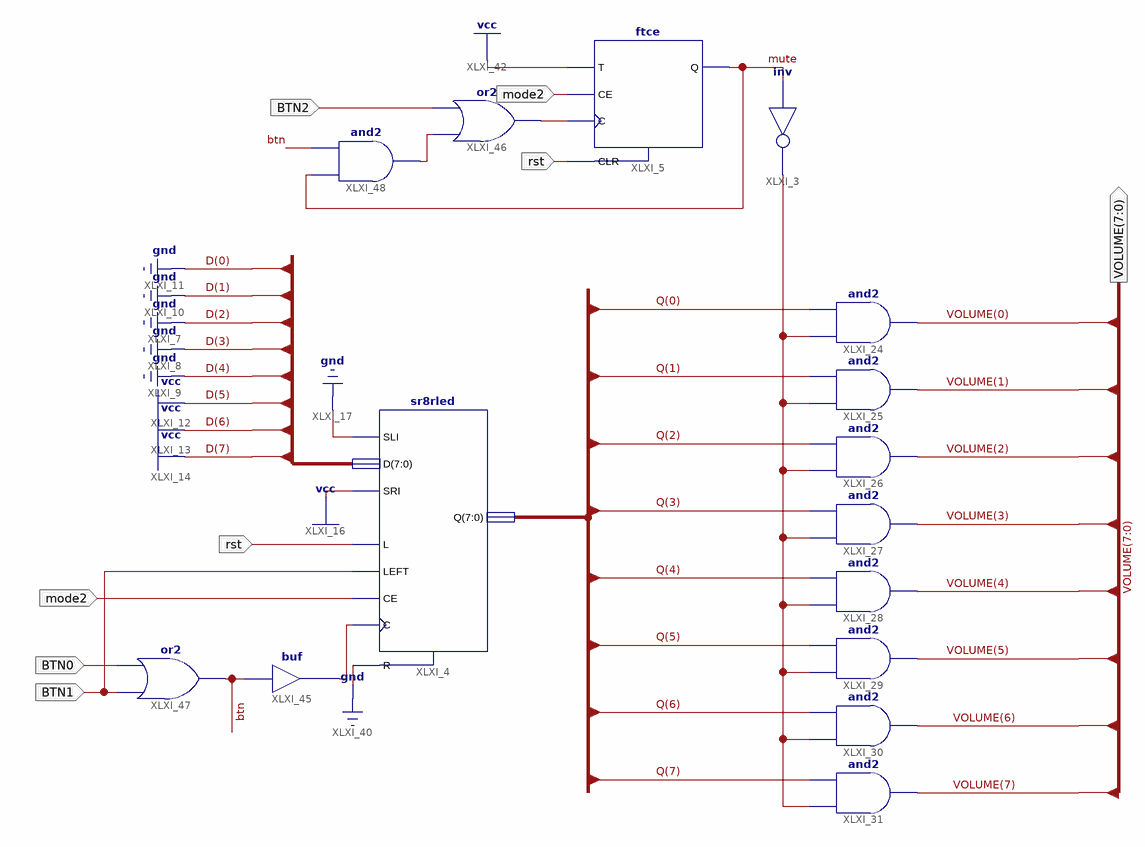
[diagram p0: schematic sheet 1]
// Xilinx ISE schematic mode_2.sch (spartan3) as structural Verilog: 15 symbols, 6 ports
module mode_2 (
  input  rst,
  input  mode2,
  input  BTN1,
  input  BTN0,
  input  BTN2,
  output [7:0] VOLUME
);

  wire btn, mute, mute_bar, XLXN_25, XLXN_82, XLXN_89;
  wire [7:0] Q, XLXN_16, XLXN_30;

  sr8rled XLXI_4 (
    .C(XLXN_25), .CE(mode2), .D(XLXN_16), .L(rst), .LEFT(BTN1), .R(1'b0), .SLI(1'b0), .SRI(1'b1), .Q(XLXN_30));
  not XLXI_3 (mute_bar, mute);
  ftce XLXI_5 (.C(XLXN_82), .CE(mode2), .CLR(rst), .T(1'b1), .Q(mute));
  and XLXI_24 (VOLUME[0], mute_bar, Q[0]);
  and XLXI_25 (VOLUME[1], mute_bar, Q[1]);
  and XLXI_26 (VOLUME[2], mute_bar, Q[2]);
  and XLXI_27 (VOLUME[3], mute_bar, Q[3]);
  and XLXI_28 (VOLUME[4], mute_bar, Q[4]);
  and XLXI_29 (VOLUME[5], mute_bar, Q[5]);
  and XLXI_30 (VOLUME[6], mute_bar, Q[6]);
  and XLXI_31 (VOLUME[7], mute_bar, Q[7]);
  buf XLXI_45 (XLXN_25, btn);
  or XLXI_46 (XLXN_82, XLXN_89, BTN2);
  or XLXI_47 (btn, BTN1, BTN0);
  and XLXI_48 (XLXN_89, mute, btn);
endmodule
